# EAGLE design Motherboard (EAGLE 9.6.2)
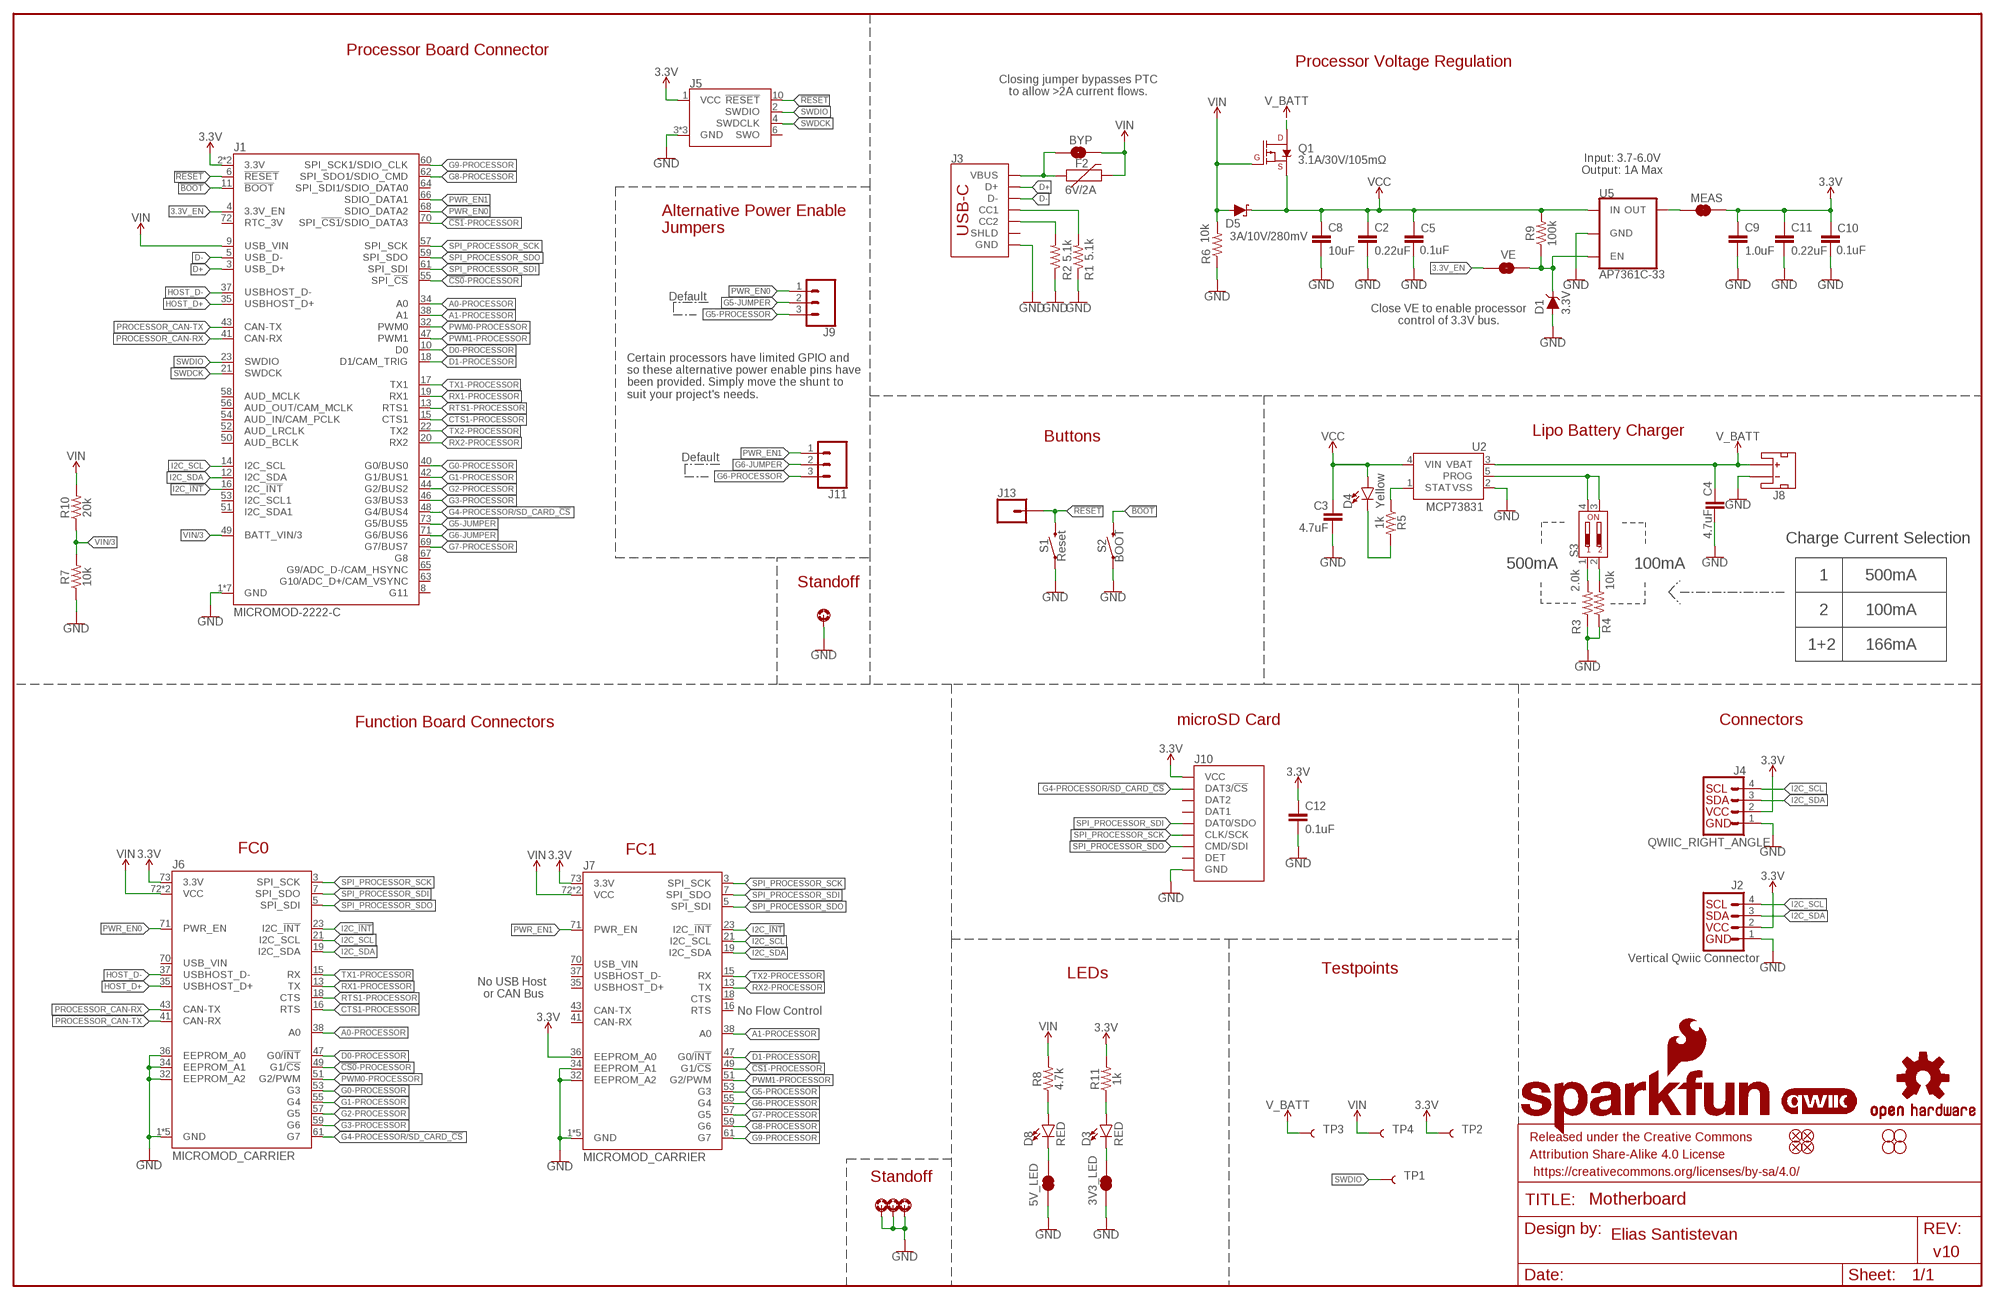
[diagram p0: schematic, sheet 1]

## Parts
3V3_LED  JUMPER-SMT_2_NC_TRACE_SILK  [SMT-JUMPER_2_NC_TRACE_SILK]
5V_LED  JUMPER-SMT_2_NC_TRACE_SILK  [SMT-JUMPER_2_NC_TRACE_SILK]
BYP  JUMPER-SMT_2_NO_SILK  [SMT-JUMPER_2_NO_SILK]
C2  0.22uF  0.22UF-0603-25V-10%  [0603]
C3  4.7uF  4.7UF-0603-6.3V-(10%)  [0603]
C4  4.7uF  4.7UF-0603-35V-(20%)  [0603]
C5  0.1uF  0.1UF-0603-25V-(+80/-20%)  [0603]
C8  10uF  10UF-0805-10V-10%  [0805]
C9  1.0uF  1.0UF-0603-16V-10%  [0603]
C10  0.1uF  0.1UF-0603-25V-(+80/-20%)  [0603]
C11  0.22uF  0.22UF-0603-25V-10%  [0603]
C12  0.1uF  0.1UF-0603-25V-(+80/-20%)  [0603]
D1  3.3V  DIODE-ZENER-MM3Z3V3T1G  [SOD-323]
D3  RED  LED-RED0603  [LED-0603]
D4  Yellow  LED-YELLOW0603  [LED-0603]
D5  3A/10V/280mV  DIODE-SCHOTTKY-BAT60A  [SOD-323]
D8  RED  LED-RED0603  [LED-0603]
F2  6V/2A  PPTC_6V2A  [1210]
FD1  FIDUCIAL1X2  [FIDUCIAL-1X2]
FD2  FIDUCIAL1X2  [FIDUCIAL-1X2]
FD3  FIDUCIAL1X2  [FIDUCIAL-1X2]
FD4  FIDUCIAL1X2  [FIDUCIAL-1X2]
FRAME1  FRAME-LEDGER  [CREATIVE_COMMONS]
H2  STAND-OFF-REFLOW-M2.5_2.5MM_TALL  [STAND-OFF-REFLOW-M2.5]
H3  STAND-OFF-REFLOW-M2.5_2.5MM_TALL  [STAND-OFF-REFLOW-M2.5]
H4  STAND-OFF-REFLOW-M2.5_2.5MM_TALL  [STAND-OFF-REFLOW-M2.5]
H8  STAND-OFF-REFLOW-M2.5_2.5MM_TALL  [STAND-OFF-REFLOW-M2.5]
H14  STAND-OFFTIGHT  [STAND-OFF-TIGHT]
H15  STAND-OFFTIGHT  [STAND-OFF-TIGHT]
H16  STAND-OFFTIGHT  [STAND-OFF-TIGHT]
H17  STAND-OFFTIGHT  [STAND-OFF-TIGHT]
J1  MICROMOD-2222-C  [M.2-CONNECTOR-E]
J2  Vertical Qwiic Connector  QWIIC_CONNECTOR  [JST04_1MM_VERT]
J3  USB_C_2-LAYER_PADS  [USB-C-16P-2LAYER-PADS]
J4  QWIIC_RIGHT_ANGLE  QWIIC_CONNECTORJS-1MM  [JST04_1MM_RA]
J5  CORTEX_JTAG_DEBUG_MINIMUM_PTH  [2X5-PTH-1.27MM]
J6  MICROMOD_CARRIER  [M.2-CONNECTOR-E-FUNCTION-STANDARD]
J7  MICROMOD_CARRIER  [M.2-CONNECTOR-E-FUNCTION-STANDARD]
J8  JST_2MM_MALE  [JST-2-SMD]
J9  CONN_03LOCK  [1X03_LOCK]
J10  MICRO-SD-PUSH-PUSH-EXT-PIN  [MICROSD-EXTERNALPIN]
J11  CONN_03LOCK  [1X03_LOCK]
J13  CONN_01PTH_NO_SILK_YES_STOP  [1X01_NO_SILK]
LOGO1  QWIIC_LOGO_8MM  [QWIIC_8MM]
LOGO2  SFE_LOGO_NAME_FLAME.3_INCH  [SFE_LOGO_NAME_FLAME_.3]
LOGO3  OSHW-LOGOL  [OSHW-LOGO-L]
MEAS  JUMPER-COMBO_2_NC_TRACE  [COMBO-JUMPER_2_NC_TRACE]
Q1  3.1A/30V/105mΩ  MOSFET_PCH-DMG2307L  [SOT23-3]
R1  5.1k  5.1KOHM5.1KOHM-0603-1/10W-1%  [0603]
R2  5.1k  5.1KOHM5.1KOHM-0603-1/10W-1%  [0603]
R3  2.0k  2.0KOHM-0603-1/10W-5%  [0603]
R4  10k  10KOHM-0603-1/10W-1%  [0603]
R5  1k  1KOHM-0603-1/10W-1%  [0603]
R6  10k  10KOHM-0603-1/10W-1%  [0603]
R7  10k  10KOHM-0603-1/10W-1%  [0603]
R8  4.7k  4.7KOHM-0603-1/10W-1%  [0603]
R9  100k  100KOHM-0603-1/10W-1%  [0603]
R10  20k  20KOHM-0603-1/10W-1%  [0603]
R11  1k  1KOHM-0603-1/10W-1%  [0603]
S1  Reset  MOMENTARY-SWITCH-SPST-SMD-5.2-TALL-REDUNDANT  [TACTILE_SWITCH_SMD_5.2MM]
S2  BOOT  MOMENTARY-SWITCH-SPST-SMD-5.2-TALL-REDUNDANT  [TACTILE_SWITCH_SMD_5.2MM]
S3  DIP-02-SMD-50MIL  [DIPSWITCH-02-50MIL]
TP1  TEST-POINT3X5  [PAD.03X.05]
TP2  TEST-POINT3X5  [PAD.03X.05]
TP3  TEST-POINT3X5  [PAD.03X.05]
TP4  TEST-POINT3X5  [PAD.03X.05]
U2  MCP73831  [SOT23-5]
U5  AP7361C-33  AP7361C-33FGEUDFN-8  [UDFN-8]
VE  JUMPER-SMT_2_NO_SILK  [SMT-JUMPER_2_NO_SILK]

## Nets
3.3V [POWER]: C9.1 C10.1 C11.1 C12.1 J1.2(3.3V) J1.74(3.3V) J2.2 J4.2 J5.1(VCC) J6.73(3.3V) J7.36(EEPROM_A0) J7.73(3.3V) J10.4(VCC) MEAS.2 MEAS.4 R11.2 TP2.1
3.3V_EN: J1.4(3.3V_EN) VE.1
3.3V_EN_VE: D1.C R9.1 U5.5(EN) VE.2
!BOOT!: J1.11(!BOOT!) S2.3 S2.4
!CS0!-PROCESSOR: J1.55(SPI_!CS!) J6.49(G1/!CS!)
!CS1!-PROCESSOR: J1.70(SPI_!CS1!/SDIO_DATA3) J7.49(G1/!CS!)
!RESET!: J1.6(!RESET!) J5.10(!RESET) J13.1 S1.3 S1.4
A0-PROCESSOR: J1.34(A0) J6.38(A0)
A1-PROCESSOR: J1.38(A1) J7.38(A0)
CTS1-PROCESSOR: J1.15(CTS1) J6.16(RTS)
D0-PROCESSOR: J1.10(D0) J6.47(G0/!INT!)
D1-PROCESSOR: J1.18(D1/CAM_TRIG) J7.47(G0/!INT!)
D+ [Diff pairs]: J1.3(USB_D+) J3.A6(D+) J3.B6(D+)
D- [Diff pairs]: J1.5(USB_D-) J3.A7(D-) J3.B7(D-)
G0-PROCESSOR: J1.40(G0/BUS0) J6.53(G3)
G1-PROCESSOR: J1.42(G1/BUS1) J6.55(G4)
G2-PROCESSOR: J1.44(G2/BUS2) J6.57(G5)
G3-PROCESSOR: J1.46(G3/BUS3) J6.59(G6)
G4-PROCESSOR/SD_CARD_!CS!: J1.48(G4/BUS4) J6.61(G7) J10.2(DAT3/!CS!)
G5-JUMPER: J1.73(G5/BUS5) J9.2
G5-PROCESSOR: J7.53(G3) J9.3
G6-JUMPER: J1.71(G6/BUS6) J11.2
G6-PROCESSOR: J7.55(G4) J11.3
G7-PROCESSOR: J1.69(G7/BUS7) J7.57(G5)
G8-PROCESSOR: J1.62(SPI_SDO1/SDIO_CMD) J7.59(G6)
G9-PROCESSOR: J1.60(SPI_SCK1/SDIO_CLK) J7.61(G7)
GND: 3V3_LED.1 5V_LED.1 C2.2 C3.2 C4.2 C5.2 C8.2 C9.2 C10.2 C11.2 C12.2 D1.A H2.1 H3.1 H4.1 H8.1 J1.1(GND) J1.7(GND) J1.33(GND) J1.36(GND) J1.39(GND) J1.45(GND) J1.75(GND) J2.1 J3.GND J3.GND2(GND) J4.1 J5.3(GND) J5.5(GND) J5.9(GND) J6.1(GND) J6.32(EEPROM_A2) J6.33(GND) J6.34(EEPROM_A1) J6.36(EEPROM_A0) J6.39(GND) J6.45(GND) J6.75(GND) J7.1(GND) J7.32(EEPROM_A2) J7.33(GND) J7.34(EEPROM_A1) J7.39(GND) J7.45(GND) J7.75(GND) J8.1(-) J10.6(GND) J10.10(GND) J10.11(GND) J10.12(GND) J10.13(GND) R1.1 R2.1 R3.1 R4.1 R6.1 R7.1 S1.1 S1.2 S2.1 S2.2 U2.2(VSS) U5.4(GND) U5.EP(GND)
HOST_D+ [Diff pairs]: J1.35(USBHOST_D+) J6.35(USBHOST_D+)
HOST_D- [Diff pairs]: J1.37(USBHOST_D-) J6.37(USBHOST_D-)
I2C_!INT!: J1.16(I2C_!INT!) J6.23(I2C_!INT!) J7.23(I2C_!INT!)
I2C_SCL: J1.14(I2C_SCL) J2.4 J4.4 J6.21(I2C_SCL) J7.21(I2C_SCL)
I2C_SDA: J1.12(I2C_SDA) J2.3 J4.3 J6.19(I2C_SDA) J7.19(I2C_SDA)
N$1: MEAS.1 MEAS.3 U5.1(OUT)
N$2: 5V_LED.2 D8.C
N$3: D3.A R11.1
N$4: J3.B5(CC2) R2.2
N$5: J3.A5(CC1) R1.2
N$6: S3.3 S3.4 U2.5(PROG)
N$7 [POWER]: BYP.1 F2.1 J3.VBUS1(VBUS) J3.VBUS2(VBUS)
N$8: R3.2 S3.1
N$9: R4.2 S3.2
N$10: 3V3_LED.2 D3.C
N$12: D8.A R8.1
N$14: D4.C R5.2
N$15: R5.1 U2.1(STAT)
PROCESSOR_CAN-RX: J1.41(CAN-RX) J6.43(CAN-TX)
PROCESSOR_CAN-TX: J1.43(CAN-TX) J6.41(CAN-RX)
PWM0-PROCESSOR: J1.32(PWM0) J6.51(G2/PWM)
PWM1-PROCESSOR: J1.47(PWM1) J7.51(G2/PWM)
PWR_EN0: J1.68(SDIO_DATA2) J6.71(PWR_EN) J9.1
PWR_EN1: J1.66(SDIO_DATA1) J7.71(PWR_EN) J11.1
RTS1-PROCESSOR: J1.13(RTS1) J6.18(CTS)
RX1-PROCESSOR: J1.19(RX1) J6.13(TX)
RX2-PROCESSOR: J1.20(RX2) J7.13(TX)
SPI_PROCESSOR_SCK: J1.57(SPI_SCK) J6.3(SPI_SCK) J7.3(SPI_SCK) J10.5(CLK/SCK)
SPI_PROCESSOR_SDI: J1.61(SPI_SDI) J6.7(SPI_SDO) J7.7(SPI_SDO) J10.7(DAT0/SDO)
SPI_PROCESSOR_SDO: J1.59(SPI_SDO) J6.5(SPI_SDI) J7.5(SPI_SDI) J10.3(CMD/SDI)
SWDCK: J1.21(SWDCK) J5.4(SWDCLK)
SWDIO: J1.23(SWDIO) J5.2(SWDIO) TP1.1
TX1-PROCESSOR: J1.17(TX1) J6.15(RX)
TX2-PROCESSOR: J1.22(TX2) J7.15(RX)
V_BATT [POWER]: C4.1 J8.2(+) Q1.3(D) TP3.1 U2.3(VBAT)
VCC: C2.1 C3.1 C5.1 C8.1 D4.A D5.C Q1.2(S) R9.2 U2.4(VIN) U5.8(IN)
VIN: BYP.2 D5.A F2.2 J1.9(USB_VIN) J6.72(VCC) J6.74(VCC) J7.72(VCC) J7.74(VCC) Q1.1(G) R6.2 R8.2 R10.2 TP4.1
VIN/3: J1.49(BATT_VIN/3) R7.2 R10.1
Unconnected: J1.8(G11) J1.50(AUD_BCLK) J1.51(I2C_SDA1) J1.52(AUD_LRCLK) J1.53(I2C_SCL1) J1.54(AUD_IN/CAM_PCLK) J1.56(AUD_OUT/CAM_MCLK) J1.58(AUD_MCLK) J1.63(G10/ADC_D+/CAM_VSYNC) J1.64(SPI_SDI1/SDIO_DATA0) J1.65(G9/ADC_D-/CAM_HSYNC) J1.67(G8) J1.72(RTC_3V) J3.SHLD1(SHLD) J3.SHLD2(SHLD) J3.SHLD3(SHLD) J3.SHLD4(SHLD) J5.6(SWO) J6.70(USB_VIN) J7.16(RTS) J7.18(CTS) J7.35(USBHOST_D+) J7.37(USBHOST_D-) J7.41(CAN-RX) J7.43(CAN-TX) J7.70(USB_VIN) J8.NC1(PAD1) J8.NC2(PAD2) J10.1(DAT2) J10.8(DAT1) J10.9(DET)

## Notes on the sheet
- Processor Board Connector
- Processor Voltage Regulation
- Closing jumper bypasses PTC
  to allow >2A current flows.
- Input: 3.7-6.0V
  Output: 1A Max
- Alternative Power Enable
  Jumpers
- Default
- Close VE to enable processor
  control of 3.3V bus.
- Certain processors have limited GPIO and
  so these alternative power enable pins have
  been provided. Simply move the shunt to 
  suit your project's needs.
- Lipo Battery Charger
- Buttons
- Default
- Charge Current Selection
- 500mA | 100mA
- 1 | 500mA
- Standoff
- 2 | 100mA
- 1+2 | 166mA
- Function Board Connectors | microSD Card | Connectors
- FC0 | FC1
- Testpoints
- LEDs
- No USB Host 
  or CAN Bus
- No Flow Control
- Standoff
- Elias Santistevan
- v10

## Library data of the parts
3V3_LED 5V_LED = SparkFun-Jumpers:JUMPER-SMT_2_NC_TRACE: Normally closed trace jumper This jumper has a trace between two pads so it's normally closed (NC). Use a razor knife to open the connection. For best results follow the IPC guidelines for cutting traces: Cutout at least 0.063 mm (0.005 in). Remove all loose material to clean up the cut area. Seal the cut with an approved epoxy. Reapply solder to reclose the connection.
BYP VE = SparkFun-Jumpers:JUMPER-SMT_2_NO: Normally open jumper This jumper has two pads in close proximity to each other. Apply solder to close the connection. Round pads are easier to solder for beginners, but are a lot larger. SparkFun Product that uses the round pads: SparkFun EL Sequencer <https://www.sparkfun.com/products/12781>
C2 C11 = SparkFun-Capacitors:0.22UF: 0.22µF ceramic capacitors A capacitor is a passive two-terminal electrical component used to store electrical energy temporarily in an electric field.; PROD_ID: CAP-07822
C3 = SparkFun-Capacitors:4.7UF: 4.7µF ceramic capacitors A capacitor is a passive two-terminal electrical component used to store electrical energy temporarily in an electric field.; PROD_ID: CAP-08280
C4 = SparkFun-Capacitors:4.7UF: 4.7µF ceramic capacitors A capacitor is a passive two-terminal electrical component used to store electrical energy temporarily in an electric field.; PROD_ID: CAP-14106
C5 C10 C12 = SparkFun-Capacitors:0.1UF: 0.1µF ceramic capacitors A capacitor is a passive two-terminal electrical component used to store electrical energy temporarily in an electric field.; PROD_ID: CAP-00810
C8 = SparkFun-Capacitors:10UF: 10.0µF ceramic capacitors A capacitor is a passive two-terminal electrical component used to store electrical energy temporarily in an electric field.; PROD_ID: CAP-11330
C9 = SparkFun-Capacitors:1.0UF: 1µF ceramic capacitors A capacitor is a passive two-terminal electrical component used to store electrical energy temporarily in an electric field.; PROD_ID: CAP-00868
D1 = SparkFun-DiscreteSemi:DIODE-ZENER: Zener Diode A Zener diode allows current to flow from its anode to its cathode like a normal semiconductor diode, but it also permits current to flow in the reverse direction when its "Zener voltage" is reached. - WIkipedia; PROD_ID: DIO-11284
D3 D8 = SparkFun-LED:LED-RED: Red SMD LED Used in manufacturing of most products at SparkFun Packages: 0603 - SMD 0603 package [Product Link] <http://docs.avagotech.com/docs/AV02-0551EN> 0603 SMART - SMD 0603 SMART package ( more efficient and expensive)[Product Link] <http://www.osram-os.com/Graphics/XPic2/00077099_0.pdf> 1206 - SMD1206 package [Product Link] <https://www.sparkfun.com/datasheets/DevTools/LilyPad/Q150OVS4.pdff> SparkFun Products: Pro Mini 328 -5V <https://www.sparkfun.com/products/821> RedBoard <https://www.sparkfun.com/products/12757> IOIO-OTG <https://www.sparkfun.com/products/13613>; PROD_ID: DIO-00819
D4 = SparkFun-LED:LED-YELLOW: Yellow SMD LED Used in manufacturing several products at SparkFun. Packages: 0603 - SMD 0603 package[Product Link] <http://www.kingbrightusa.com/product.asp?catalog_name=LED&product_id=APT1608SYCK> 0603 -SMART - SMART SMD 0603 package (more efficient/more expensive) [Product Link] <http://www.osram-os.com/osram_os/en/products/product-catalog/led-light-emitting-diodes/smartled-0603/ly-l29k/index.jsp> LilyPad - SMD1206 package[Product Datasheet] <https://www.sparkfun.com/datasheets/DevTools/LilyPad/Q150YUS4.pdf> SparkFun Products: Blynk Board <https://www.sparkfun.com/products/13794> IOIO-OTG <https://www.sparkfun.com/products/13613> XBee Explorer Serial <https://www.sparkfun.com/products/13225>; PROD_ID: DIO-09003
D5 = SparkFun-DiscreteSemi:DIODE-SCHOTTKY: Schottky diode A Schottky diode is a semiconductor diode which has a low forward voltage drop and a very fast switching action.; PROD_ID: DIO-14072
F2 = SparkFun-Fuses:PPTC: Resettable Fuse PPTC Resettable Fuse. Really a sort of resistor with a polymeric positive temperature coefficient whose resistance increases dramatically with an increase in temperature. When heated by the power passing through the resistance rises causing the current to be limited, protecting the circuit. This is achieved by the transition of the polymer from a crystalline to an amorphous state where the conductive carbon separates breaking the conductive pathways found in the cool crystalline structure. When a PPTC cools back down it resumes conducting letting the circuit turn back on. SparkFun Products: SparkFun RedBoard - Programmed with Arduino <https://www.sparkfun.com/products/12757> Pro Micro - 5V/16MHz <https://www.sparkfun.com/products/12640> Arduino Pro 328 - 5V/16MHz <https://www.sparkfun.com/products/10915> MP3 Trigger <https://www.sparkfun.com/products/13720>; PROD_ID: RES-14313
FD1-FD4 = SparkFun-Aesthetics:FIDUCIAL: Fiducial Alignment Points Point-of-reference for pick-and-place machines and other optical instruments.
FRAME1 = SparkFun-Aesthetics:FRAME-LEDGER: Schematic Frame - Ledger Standard 11x14 US Ledger frame
H2-H4 H8 = SparkFun-Hardware:STAND-OFF-REFLOW: Stand Off Reflow Compatible A metal standoff that can be placed and reflowed onto a PCB. The M2.5 x 2.5mm variant is used on MicroMod. The M2.0 x 6.0mm variant is used to mount the Iridium 9603N modem.; PROD_ID: HW-14899
H14-H17 = SparkFun-Hardware:STAND-OFF: Stand Off Drill holes for mechanically mounting via screws, standoffs, etc. Note: Use the keepout ring to avoid running the screw head into surrounding components. Variant Overviews STAND-OFF - Mechanical footprint for a #4 phillips button head screw. STAND-OFF-TIGHT - Mechanical footprint for a #4 phillips button head screw, Example SparkFun Products Screw - Phillips Head (1/4", 4-40, 10 pack) <https://www.sparkfun.com/products/10453> (PRT-10453) Screw - Phillips Head (1/2", 4-40, 10 pack) <https://www.sparkfun.com/products/10452> (PRT-10452) Screw - Phillips Head (3/4", 4-40, 10 pack) <https://www.sparkfun.com/products/10451> (PRT-10451) Screw - Phillips Head (1", 4-40, 10 pack) <https://www.sparkfun.com/products/10450> (PRT-10450)
J1 = SparkFun-MicroMod:MICROMOD: MicroMod Connector Description: A card edge connector and mating PCB connector to allow various MicroMod Processor Boards to be coupled with various carrier boards of different capabilities. Based on the M.2 standard.; PROD_ID: CONN-14877
J2 = SparkFun-Connectors:QWIIC_CONNECTOR: SparkFun I2C Standard Qwiic Connector An SMD 1mm pitch JST connector makes it easy and quick (get it? Qwiic?) to connect I2C devices to each other. The Qwiic system <http://www.sparkfun.com/qwiic> enables fast and solderless connection between popular platforms and various sensors and actuators. We carry 200mm <https://www.sparkfun.com/products/14204>, 100mm <https://www.sparkfun.com/products/14205>, 50mm <https://www.sparkfun.com/products/14206>, and breadboard friendly <https://www.sparkfun.com/products/14207> Qwiic cables. We also offer 10 pcs strips <https://www.sparkfun.com/products/14323> the SMD connectors.; PROD_ID: CONN-14483
J3 = SparkFun-Connectors:USB_C: USB Type C 16Pin Connector Super Speed pins not available on the 16-pin purely SMD connector so this part is best for USB 2.0 implementations. D1 and D2 are tied together enabling D+/- no matter which way the cable is plugged into the connector. The two channel configuration pins (CC1/2) are exposed. These are normally connected to ground via 5.1k resistors but can be reconfigured for high current/high power applications. **4-LAYER BOARD WARNING!!** If designing 4-layer board, make sure to select the variant _4-LAYER-ISOLATED. The linked footprint (USB-C-16-4LAYER-ISOLATED) includes some very necessary cutout polygons in the inner layers (2 and 15). This prevents the PTH mounting shield legs on the USB connector from electrically connecting any other polygons on the inner layers (usually VCC and GND).; PROD_ID: CONN-14122
J4 = SparkFun-Connectors:QWIIC_CONNECTOR: SparkFun I2C Standard Qwiic Connector An SMD 1mm pitch JST connector makes it easy and quick (get it? Qwiic?) to connect I2C devices to each other. The Qwiic system <http://www.sparkfun.com/qwiic> enables fast and solderless connection between popular platforms and various sensors and actuators. We carry 200mm <https://www.sparkfun.com/products/14204>, 100mm <https://www.sparkfun.com/products/14205>, 50mm <https://www.sparkfun.com/products/14206>, and breadboard friendly <https://www.sparkfun.com/products/14207> Qwiic cables. We also offer 10 pcs strips <https://www.sparkfun.com/products/14323> the SMD connectors.; PROD_ID: CONN-13694
J5 = SparkFun-Connectors:CORTEX_JTAG_DEBUG_MINIMUM: Cortex Debug Connector - 10 pin Supports JTAG debug, Serial Wire debug, and Serial Wire Viewer. PTH and SMD connector options available. General Connector Information <http://infocenter.arm.com/help/topic/com.arm.doc.faqs/attached/13634/cortex_debug_connectors.pdf> Products: PTH Connector <http://www.digikey.com/product-detail/en/cnc-tech/3220-10-0100-00/1175-1627-ND/3883661> -via Digi-Key SparkFun PSoc <https://www.sparkfun.com/products/13229> SparkFun T <https://www.sparkfun.com/products/13810>
J6 J7 = SparkFun-MicroMod-Function:MICROMOD: MicroMod Connector Description: A card edge connector and mating PCB connector to allow various MicroMod Processor Boards to be coupled with various carrier boards of different capabilities. Based on the M.2 standard.; PROD_ID: CONN-14877
J8 = SparkFun-Connectors:JST_2MM_MALE: JST 2MM MALE RA CONNECTOR Two pin, compact surface mount connector. Commonly used as a battery input connection point. We really like the solid locking feeling and high current rating on these small connectors. We use these all the time as battery connectors. Mates to single-cell LiPo batteries. Here is the connector we sell at SparkFun: JST Right Angle Connector - White <https://www.sparkfun.com/products/8612> (PRT-08612) Datasheet <http://www.sparkfun.com/datasheets/Prototyping/Connectors/JST-Horizontal.pdf> It was used on these SparkFun products: SparkFun MOSFET Power Controller <https://www.sparkfun.com/products/11214> (PRT-11214) SparkFun Battery Babysitter - LiPo Battery Manager <https://www.sparkfun.com/products/13777> (PRT-13777) And many, many others that required a lipo battery connection.; PROD_ID: CONN-11443; SF_ID: PRT-08612
J9 J11 = SparkFun-Connectors:CONN_03: Multi connection point. Often used as Generic Header-pin footprint for 0.1 inch spaced/style header connections On any of the 0.1 inch spaced packages, you can populate with these: Break Away Headers - Straight <https://www.sparkfun.com/products/116> (PRT-00116) Break Away Male Headers - Right Angle <https://www.sparkfun.com/products/553> (PRT-00553) Female Headers <https://www.sparkfun.com/products/115> (PRT-00115) Break Away Headers - Machine Pin <https://www.sparkfun.com/products/117> (PRT-00117) Break Away Female Headers - Swiss Machine Pin <https://www.sparkfun.com/products/743> (PRT-00743) Stackable Header - 3 Pin (Female, 0.1") <https://www.sparkfun.com/products/13875> (PRT-13875) For SCREWTERMINALS and SPRING TERMINALS visit here: Screw Terimnals on SparkFun.com <https://www.sparkfun.com/search/results?term=Screw+Terminals> (5mm/3.5mm/2.54mm spacing) This device is also useful as a general connection point to wire up your design to another part of your project. Our various solder wires solder well into these plated through hole pads. Hook-Up Wire - Assortment (Stranded, 22 AWG) <https://www.sparkfun.com/products/11375> (PRT-11375) Hook-Up Wire - Assortment (Solid Core, 22 AWG) <https://www.sparkfun.com/products/11367> (PRT-11367) View the entire wire category on our website here <https://www.sparkfun.com/categories/141> Special notes: Molex polarized connector foot print use with SKU : PRT-08232 with associated crimp pins and housings.
J10 = SparkFun-Connectors:MICRO-SD: microSD Socket for Transflash Various sockets for µSD. tDoc lines correctly indicate media card edge positions when inserting (unlocked, locked, depressed). NOTE: CD1 and CD2 are connected internally, and the default detect state of the socket is detect pin to ground. SparkFun Products: WAV Trigger <https://www.sparkfun.com/products/13660> CAN-Bus Shield <https://www.sparkfun.com/products/13262> SparkFun Level Shifing microSD Breakout <https://www.sparkfun.com/products/13743>; PROD_ID: CONN-16110
J13 = SparkFun-Connectors:CONN_01: Single connection point. Often used as Generic Header-pin footprint for 0.1 inch spaced/style header connections On any of the 0.1 inch spaced packages, you can populate with these: Break Away Headers - Straight <https://www.sparkfun.com/products/116> (PRT-00116) Break Away Male Headers - Right Angle <https://www.sparkfun.com/products/553> (PRT-00553) Female Headers <https://www.sparkfun.com/products/115> (PRT-00115) Break Away Headers - Machine Pin <https://www.sparkfun.com/products/117> (PRT-00117) Break Away Female Headers - Swiss Machine Pin <https://www.sparkfun.com/products/743> (PRT-00743) This device is also useful as a general connection point to wire up your design to another part of your project. Our various solder wires solder well into these plated through hole pads. Hook-Up Wire - Assortment (Stranded, 22 AWG) <https://www.sparkfun.com/products/11375> (PRT-11375) Hook-Up Wire - Assortment (Solid Core, 22 AWG) <https://www.sparkfun.com/products/11367> (PRT-11367) View the entire wire category on our website here <https://www.sparkfun.com/categories/141> Special notes: SMTSO-256-ET is a "flush mount" nut for a 4-40 screw. We mostly use this on specialty testbeds; it is a nice way to connect hardware to your PCB at an adjustable hieght. Also note, the SNAP packages are for using a snappable style connector. We sell a baggie of snaps and they are also used on two LilyPad designs: Snap Assortment - 30 pack (male and female) <https://www.sparkfun.com/products/11347> (DEV-11347) LilyPad Arduino SimpleSnap <https://www.sparkfun.com/products/10941> (DEV-10941) LilyPad SimpleSnap Protoboard <https://www.sparkfun.com/products/10940> (DEV-10940)
LOGO1 = SparkFun-Aesthetics:QWIIC_LOGO: Qwiic Logos for placement on schematic and PCB. The 5.5mm silk logo is best for placing next to Qwiic connector.
LOGO2 = SparkFun-Aesthetics:SFE_LOGO_NAME_FLAME: SparkFun Font Logo w/ Flame This is the SparkFun full logo. The logo on the schematic will always be the same size; the package variant is the height of the flame part of the logo. Default layer for the logo on the board is tSilk.
LOGO3 = SparkFun-Aesthetics:OSHW-LOGO: Open-Source Hardware (OSHW) Logo This logo indicates the piece of hardware it is found on incorporates a OSHW license and/or adheres to the definition of open source hardware found here: http://freedomdefined.org/OSHW
MEAS = SparkFun-Jumpers:JUMPER-COMBO_2_NC_TRACE
Q1 = SparkFun-DiscreteSemi:MOSFET_PCH: P-channel MOSFETs Voltage controlled devices that allow control of high current outputs. SparkFun Products: SparkFun ESP32 Thing <https://www.sparkfun.com/products/13907> SparkFun ESP8266 Thing <https://www.sparkfun.com/products/13231> SparkFun Pi Servo HAT V2 <https://www.sparkfun.com/products/15316> DMG2305UX-7 (20V/4.2A/SOT23-3); PROD_ID: TRANS-11308
R1 R2 = SparkFun-Resistors:5.1KOHM; PROD_ID: RES-12083
R3 = SparkFun-Resistors:2.0KOHM: 2kΩ resistor A resistor is a passive two-terminal electrical component that implements electrical resistance as a circuit element. Resistors act to reduce current flow, and, at the same time, act to lower voltage levels within circuits. - Wikipedia; PROD_ID: RES-08296
R4 R6 R7 = SparkFun-Resistors:10KOHM: 10kΩ resistor A resistor is a passive two-terminal electrical component that implements electrical resistance as a circuit element. Resistors act to reduce current flow, and, at the same time, act to lower voltage levels within circuits. - Wikipedia; PROD_ID: RES-00824
R5 R11 = SparkFun-Resistors:1KOHM: 1kΩ resistor A resistor is a passive two-terminal electrical component that implements electrical resistance as a circuit element. Resistors act to reduce current flow, and, at the same time, act to lower voltage levels within circuits. - Wikipedia; PROD_ID: RES-07856
R8 = SparkFun-Resistors:4.7KOHM: 4.7kΩ resistor A resistor is a passive two-terminal electrical component that implements electrical resistance as a circuit element. Resistors act to reduce current flow, and, at the same time, act to lower voltage levels within circuits. - Wikipedia; PROD_ID: RES-07857
R9 = SparkFun-Resistors:100KOHM: 100kΩ resistor A resistor is a passive two-terminal electrical component that implements electrical resistance as a circuit element. Resistors act to reduce current flow, and, at the same time, act to lower voltage levels within circuits. - Wikipedia; PROD_ID: RES-07828
R10 = SparkFun-Resistors:20KOHM: 20kΩ resistor A resistor is a passive two-terminal electrical component that implements electrical resistance as a circuit element. Resistors act to reduce current flow, and, at the same time, act to lower voltage levels within circuits. - Wikipedia; PROD_ID: RES-09383
S1 S2 = SparkFun-Switches:MOMENTARY-SWITCH-SPST: Momentary Switch (Pushbutton) - SPST Normally-open (NO) SPST momentary switches (buttons, pushbuttons). Variants PTH-12MM - 12mm square, through-hole Momentary Pushbutton Switch - 12mm Square <https://www.sparkfun.com/products/9190> (COM-09190) PTH-6.0MM, PTH-6.0MM-KIT - 6.0mm square, through-hole Mini Pushbutton Switch <https://www.sparkfun.com/products/97> (COM-00097) KIT package intended for soldering kit's - only one side of pads' copper is exposed. PTH-RIGHT-ANGLE-KIT - Right-angle, through-hole Right Angle Tactile Button <https://www.sparkfun.com/products/10791> - Used on SparkFun BigTime Watch Kit <https://www.sparkfun.com/products/11734> SMD-12MM - 12mm square, surface-mount Tactile Button - SMD (12mm) <https://www.sparkfun.com/products/12993> (COM-12993) Used on SparkFun PicoBoard <https://www.sparkfun.com/products/11888> SMD-4.5MM - 4.5mm Square Trackball Switch Used on SparkFun Blackberry Trackballer Breakout <https://www.sparkfun.com/products/13169> SMD-4.6MMX2.8MM - 4.60mm x 2.80mm, surface mount Used on SparkFun Pro Micro - RP2040 <https://www.sparkfun.com/products/17717> SMD-5.2MM, SMD-5.2-REDUNDANT - 5.2mm square, surface-mount Mini Pushbutton Switch - SMD <https://www.sparkfun.com/products/8720> (COM-08720) Used on Arduino Pro Mini <https://www.sparkfun.com/products/11114> REDUNDANT package connects both switch circuits together SMD-6.0X3.5MM - 6.0 x 3.5mm, surface mount Momentary Reset Switch SMD <https://www.sparkfun.com/products/8229> (COM-08229) SMD-6.2MM-TALL - 6.2mm square, surface mount Tactile Button - SMD (6mm) <https://www.sparkfun.com/products/12992> Used on SparkFun Digital Sandbox <https://www.sparkfun.com/products/12651> SMD-RIGHT-ANGLE - Right-angle, surface mount Used on SparkFun Block for Intel® Edison - Arduino <https://www.sparkfun.com/products/13036>; PROD_ID: SWCH-14139
S3 = SparkFun-Switches:DIP-02: 2-Position DIP Switch 2-circuit DIP (dual inline package) switch. Commonly used to physcially set a circuit's behavior. Variants PTH-100MIL - Through-hole, 0.1"-Pitch Used on SparkFun Stepoko <https://www.sparkfun.com/products/13899> (ROB-13899) SMD-50MIL-JWING - SMD (J-Wing Pads), 0.05"-Pitch Prototype Part SMD-50MIL - SMD, 0.05"-Pitch Used on SparkFun Battery Babysitter <https://www.sparkfun.com/products/13777> (PRT-13777); PROD_ID: SWCH-13215
TP1-TP4 = SparkFun-Connectors:TEST-POINT: SparkFun Test Points Bare copper test points for troubleshooting or In-Circuit-Testing. These are used by our Production team for verifying production board runs using pogo-pins on test beds. SparkFun Products: SparkFun LSM9DS1 Breakout <https://www.sparkfun.com/products/13284> SparkFun PSOC <https://www.sparkfun.com/products/13714> SparkFun Load Cell Amplifier <https://www.sparkfun.com/products/13879>
U2 = SparkFun-IC-Power:MCP73831: MCP73831T Li-Ion, Li-Pol Controller Miniature single cell, fully integrated Li-Ion, Li-polymer charge management controller Datasheet <http://ww1.microchip.com/downloads/en/DeviceDoc/20001984g.pdf> SparkFun Products: SparkFun ESP32 Thing <https://www.sparkfun.com/products/13907> SparkFun 9DoF Razor IMU M0 <https://www.sparkfun.com/products/14001>; PROD_ID: IC-09995
U5 = SparkFun-IC-Power:AP7361C-33FGE: AP7361C 3.3V LDO Regulator; PROD_ID: VREG-14094

## Net classes
0 default: width 0.178 mm, drill 0.305 mm
1 POWER: width 0.559 mm, drill 0.305 mm
2 Diff pairs: width 0.203 mm, drill 0.305 mm

## Board
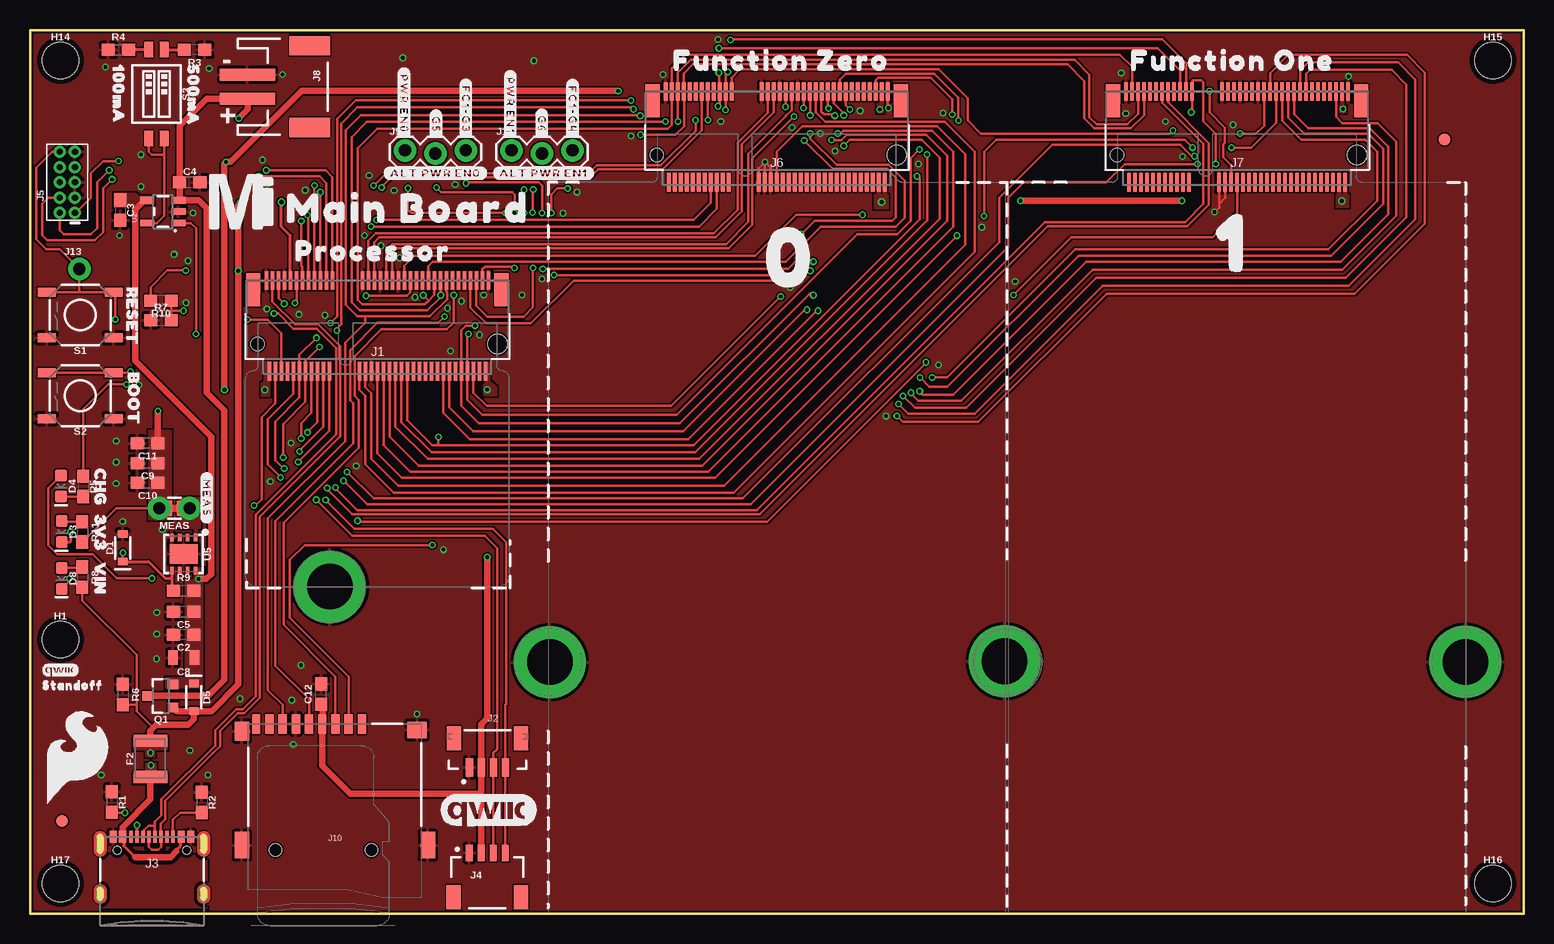
[diagram p1: board, top side]
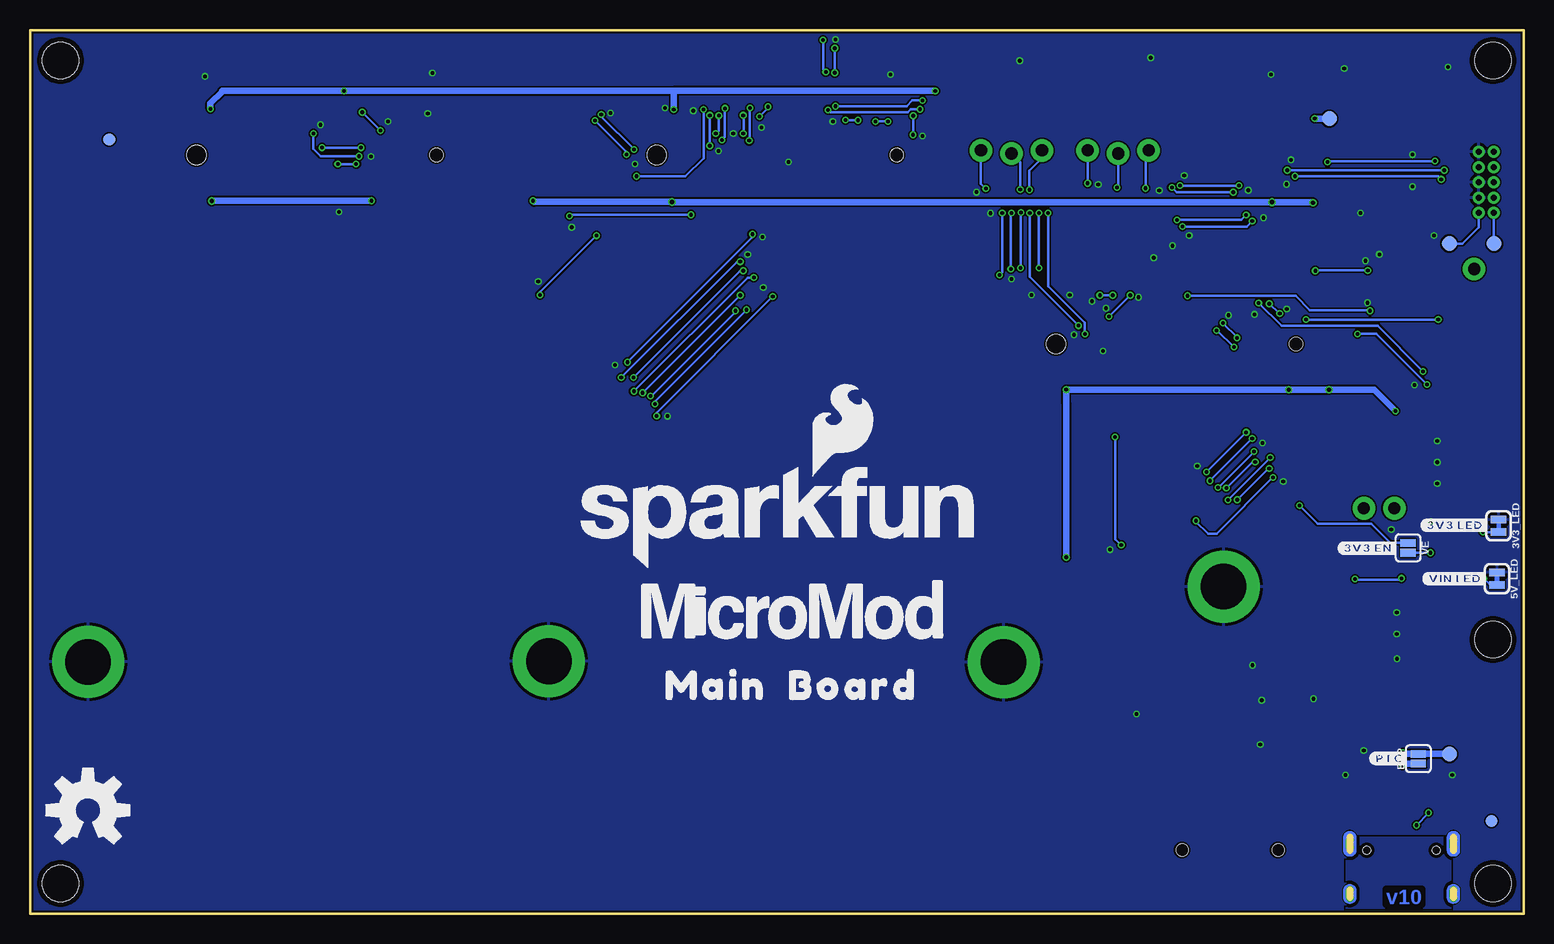
[diagram p2: board, bottom side, seen from below]

Size 124.46 x 73.66 mm. Coordinates in mm from the lower left corner, seen from the top.
Outline: 124.46,0 0,0 0,73.66 124.46,73.66 124.46,0
Copper layers (1*16): Top 0.035mm / dielectric 1.5mm / Bottom 0.035mm
Design rules "SparkFun-2-Layer-Minimum-JLCPCB": minimum track width 5mil, minimum drill 0.3mm, track to track 5mil, track to pad 5mil, pad to pad 5mil, via to via 5mil, smd to smd 5mil, copper to edge 7mil, drill to drill 7mil, minimum pad ring 5mil, minimum via ring 5mil, stop-mask expansion 2.5mil, vias tented up to drill 25mil, thermal gap 10mil
tRestrict: area 99.3,60.8 to 99.4,61.1; area 98.7,60.8 to 98.9,61.2; area 61.4,60.8 to 61.5,61.2; area 60.9,60.8 to 61,61.2

### Footprints (pad centres in the part's own frame; a part is rotated, then mirrored left to right if it is on the bottom)
SMT-JUMPER_2_NC_TRACE_SILK = smd 0.66 x 1.27: 1 -0.521,0; 2 0.521,0
SMT-JUMPER_2_NO_SILK = smd 0.635 x 1.27: 1 -0.406,0; 2 0.406,0
0603 = smd 1.1 x 1: 1 -0.85,0; 2 0.85,0
0805 = smd 0.8 x 1.2: 1 -0.9,0; 2 0.9,0
SOD-323 = smd 0.63 x 0.83: A 1.15,0; C -1.15,0
LED-0603 = smd 1 x 1: A -0.877,0; C 0.877,0
1210 = smd 1 x 2.8: 1 -1.5,0; 2 1.5,0
FIDUCIAL-1X2 = smd 1 x 1: 1 0,0
STAND-OFF-TIGHT = hole 3.048: 0,0
STAND-OFF-REFLOW-M2.5 = drill 3.8 pad 6: 1 0,0
M.2-CONNECTOR-E = smd 0.3 x 1.55: 1 9.25,-5.275; 2 9,2.275; 3 8.75,-5.275; 4 8.5,2.275; 5 8.25,-5.275; 6 8,2.275; 7 7.75,-5.275; 8 7.5,2.275; 9 7.25,-5.275; 10 7,2.275; 11 6.75,-5.275; 12 6.5,2.275; 13 6.25,-5.275; 14 6,2.275; 15 5.75,-5.275; 16 5.5,2.275; 17 5.25,-5.275; 18 5,2.275; 19 4.75,-5.275; 20 4.5,2.275; 21 4.25,-5.275; 22 4,2.275; 23 3.75,-5.275; 32 1.5,2.275; 33 1.25,-5.275; 34 1,2.275; 35 0.75,-5.275; 36 0.5,2.275; 37 0.25,-5.275; 38 0,2.275; 39 -0.25,-5.275; 40 -0.5,2.275; 41 -0.75,-5.275; 42 -1,2.275; 43 -1.25,-5.275; 44 -1.5,2.275; 45 -1.75,-5.275; 46 -2,2.275; 47 -2.25,-5.275; 48 -2.5,2.275; 49 -2.75,-5.275; 50 -3,2.275; 51 -3.25,-5.275; 52 -3.5,2.275; 53 -3.75,-5.275; 54 -4,2.275; 55 -4.25,-5.275; 56 -4.5,2.275; 57 -4.75,-5.275; 58 -5,2.275; 59 -5.25,-5.275; 60 -5.5,2.275; 61 -5.75,-5.275; 62 -6,2.275; 63 -6.25,-5.275; 64 -6.5,2.275; 65 -6.75,-5.275; 66 -7,2.275; 67 -7.25,-5.275; 68 -7.5,2.275; 69 -7.75,-5.275; 70 -8,2.275; 71 -8.25,-5.275; 72 -8.5,2.275; 73 -8.75,-5.275; 74 -9,2.275; 75 -9.25,-5.275 | smd 1.2 x 2.75: A1 10.35,-4.5; A2 -10.35,-4.5 | hole 1.1: 10,0 | hole 1.6: -10,0
JST04_1MM_VERT = smd 0.6 x 1.55: 1 -1.478,0.775; 2 -0.478,0.775; 3 0.522,0.775; 4 1.522,0.775 | smd 1.2 x 2: NC1 -2.778,3.2; NC2 2.822,3.2
USB-C-16P-2LAYER-PADS = smd 0.3 x 1: A5 -1.25,-0.34; A6 -0.25,-0.34; A7 0.25,-0.34; A8 1.25,-0.34; B5 1.75,-0.34; B6 0.75,-0.34; B7 -0.75,-0.34; B8 -1.75,-0.34 | smd 0.6 x 1: GND -3.225,-0.34; GND2 3.225,-0.34; VBUS1 -2.45,-0.34; VBUS2 2.45,-0.34 | drill 0.4 pad 0.6 long: SHLD1 -4.318,-0.915; SHLD2 4.318,-0.915; SHLD3 -4.318,-5.095; SHLD4 4.318,-5.095 | hole 0.65: -2.89,-1.445; 2.89,-1.445
JST04_1MM_RA = smd 0.6 x 1.35: 1 -1.5,0; 2 -0.5,0; 3 0.5,0; 4 1.5,0 | smd 1.2 x 2: NC1 2.8,-3.675; NC2 -2.8,-3.675
2X5-PTH-1.27MM = drill 0.508 pad 1: 1 -2.54,-0.635; 2 -2.54,0.635; 3 -1.27,-0.635; 4 -1.27,0.635; 5 0,-0.635; 6 0,0.635; 7 1.27,-0.635; 8 1.27,0.635; 9 2.54,-0.635; 10 2.54,0.635
M.2-CONNECTOR-E-FUNCTION-STANDARD = smd 0.3 x 1.55: 1 9.25,-5.275; 2 9,2.275; 3 8.75,-5.275; 4 8.5,2.275; 5 8.25,-5.275; 6 8,2.275; 7 7.75,-5.275; 8 7.5,2.275; 9 7.25,-5.275; 10 7,2.275; 11 6.75,-5.275; 12 6.5,2.275; 13 6.25,-5.275; 14 6,2.275; 15 5.75,-5.275; 16 5.5,2.275; 17 5.25,-5.275; 18 5,2.275; 19 4.75,-5.275; 20 4.5,2.275; 21 4.25,-5.275; 22 4,2.275; 23 3.75,-5.275; 32 1.5,2.275; 33 1.25,-5.275; 34 1,2.275; 35 0.75,-5.275; 36 0.5,2.275; 37 0.25,-5.275; 38 0,2.275; 39 -0.25,-5.275; 40 -0.5,2.275; 41 -0.75,-5.275; 42 -1,2.275; 43 -1.25,-5.275; 44 -1.5,2.275; 45 -1.75,-5.275; 46 -2,2.275; 47 -2.25,-5.275; 48 -2.5,2.275; 49 -2.75,-5.275; 50 -3,2.275; 51 -3.25,-5.275; 52 -3.5,2.275; 53 -3.75,-5.275; 54 -4,2.275; 55 -4.25,-5.275; 56 -4.5,2.275; 57 -4.75,-5.275; 58 -5,2.275; 59 -5.25,-5.275; 60 -5.5,2.275; 61 -5.75,-5.275; 62 -6,2.275; 63 -6.25,-5.275; 64 -6.5,2.275; 65 -6.75,-5.275; 66 -7,2.275; 67 -7.25,-5.275; 68 -7.5,2.275; 69 -7.75,-5.275; 70 -8,2.275; 71 -8.25,-5.275; 72 -8.5,2.275; 73 -8.75,-5.275; 74 -9,2.275; 75 -9.25,-5.275 | smd 1.2 x 2.75: A1 10.35,-4.5; A2 -10.35,-4.5 | hole 1.1: 10,0 | hole 1.6: -10,0
JST-2-SMD = smd 1 x 4.6: 1 -1,-3.7; 2 1,-3.7 | smd 1.6 x 3.4: NC1 -3.4,1.5; NC2 3.4,1.5
1X03_LOCK = drill 1.016 pad 1.88: 1 0,0.127; 2 2.54,-0.127; 3 5.08,0.127
MICROSD-EXTERNALPIN = smd 0.7 x 1.6: 1 2.25,10.5; 2 1.15,10.5; 3 0.05,10.5; 4 -1.05,10.5; 5 -2.15,10.5; 6 -3.25,10.5; 7 -4.35,10.5; 8 -5.45,10.5; 9 -6.55,10.5 | smd 1.2 x 1.6: 10 -7.75,9.9 | smd 1.2 x 2.2: 11 -7.75,0.4; 12 7.75,0.4 | smd 1.6 x 1.4: 13 6.85,10 | hole 1: 3.05,0; -4.95,0
1X01_NO_SILK = drill 1.016 pad 1.88: 1 0,0
COMBO-JUMPER_2_NC_TRACE = smd 0.635 x 1.27: 1 -0.508,0; 2 0.508,0 | drill 1.016 pad 1.88: 3 -1.27,0; 4 1.27,0
SOT23-3 = smd 0.8 x 0.9: 1 -0.95,-1; 2 0.95,-1; 3 0,1.1
TACTILE_SWITCH_SMD_5.2MM = smd 1.524 x 0.762: 1 -2.794,1.905; 2 2.794,1.905; 3 -2.794,-1.905; 4 2.794,-1.905
DIPSWITCH-02-50MIL = smd 0.762 x 1.27: 1 -0.635,-3.7; 2 0.635,-3.7; 3 0.635,3.7; 4 -0.635,3.7
PAD.03X.05 = smd 1.27 x 1.27: 1 0,0
SOT23-5 = smd 0.55 x 1.2: 1 -0.95,-1.3; 2 0,-1.3; 3 0.95,-1.3; 4 0.95,1.3; 5 -0.95,1.3
UDFN-8 = smd 0.3 x 0.65: 1 -0.975,-1.375; 2 -0.325,-1.375; 3 0.325,-1.375; 4 0.975,-1.375; 5 0.975,1.375; 6 0.325,1.375; 7 -0.325,1.375; 8 -0.975,1.375 | smd 2.35 x 1.6: EP 0,0

### Placement (x,y rotation side)
3V3_LED  2.08,32.35 270 bottom
5V_LED  2.21,27.93 270 bottom
BYP  8.76,12.93 90 bottom
C2  12.8,23.27 180 top
C3  7.52,58.65 270 top
C4  13.31,60.99 0 top
C5  12.8,25.17 180 top
C8  12.8,21.36 180 top
C9  9.8,37.57 180 top
C10  9.8,35.92 180 top
C11  9.8,39.22 180 top
C12  24.26,18.31 90 top
D1  7.72,30.51 90 top
D3  2.64,31.87 270 top
D4  2.59,35.66 270 top
D5  13.67,18.06 270 top
D8  2.64,27.96 270 top
F2  10.03,12.93 90 top
FD1  117.86,64.52 0 bottom
FD2  117.86,64.52 0 top
FD3  2.67,7.75 90 top
FD4  2.67,7.75 270 bottom
FRAME1  16.51,-25.4 0 top  (outside the outline)
FRAME2  FRAME-LEDGERNO_FOOTPRINT  [DUMMY]  16.51,-25.4 0 top  (outside the outline)
H1  STAND-OFFTIGHT  [STAND-OFF-TIGHT]  2.54,22.86 0 top
H2  81.22,21.06 0 top
H3  119.62,21.01 270 top
H4  43.32,20.98 270 top
H8  25,27.27 270 top
H14  2.54,71.12 0 top
H15  121.92,71.12 0 top
H16  121.92,2.54 0 top
H17  2.54,2.54 0 top
J1  28.96,47.5 180 top
J2  38.1,11.43 0 top
J3  10.16,6.76 0 top
J4  38.1,5.08 0 top
J5  3.11,60.97 90 top
J6  62.23,63.25 180 top
J7  100.58,63.25 180 top
J8  21.82,68.94 270 top
J9  31.24,63.5 0 top
J10  25.4,5.33 0 top
J11  40.13,63.5 0 top
J13  4.11,53.75 0 top
LOGO1  38.23,8.64 0 top
LOGO2  62.23,33.02 0 bottom
LOGO3  119.63,8.64 0 bottom
MEAS  12.04,33.81 180 top
Q1  10.92,18.16 90 top
R1  6.83,9.32 270 top
R2  14.33,9.3 270 top
R3  13.72,72.01 180 top
R4  7.37,72.01 0 top
R5  4.45,35.63 270 top
R6  7.75,18.29 270 top
R7  10.92,49.48 0 top
R8  4.37,28.06 270 top
R9  12.8,26.95 0 top
R10  10.92,51.1 180 top
R11  4.37,31.84 270 top
S1  4.19,49.91 180 top
S2  4.19,43.18 180 top
S3  10.54,68.33 180 top
TP1  2.44,55.86 0 bottom
TP2  6.17,55.87 180 bottom
TP3  16.18,66.27 270 bottom
TP4  6.17,13.31 0 bottom
U2  11.07,58.52 90 top
U5  12.8,30 180 top
U$1  [#3V3_EN#18]  12.95,30.48 0 bottom
U$2  [#3V3_LED#17]  5.71,32.38 0 bottom
U$3  [#VIN_LED#16]  5.71,27.94 0 bottom
U$4  [3V332533]  5.84,31.75 270 top
U$5  [VIN32532]  5.84,27.94 270 top
U$6  [CHG32531]  5.84,35.56 270 top
U$7  [#PTC#18]  11.18,12.95 0 bottom
U$8  [BOOT32541]  8.64,42.93 270 top
U$9  [RESET32540]  8.51,49.78 270 top
U$10  [PROCESSOR525]  28.57,55.24 0 top
U$11  [FUNCTION_ZERO520]  62.61,71.12 0 top
U$12  [FUNCTION_ONE524]  100.2,71.12 0 top
U$13  [MAIN523]  67.31,19.05 0 bottom
U$14  [MICROMOD_MI_LOGO_1]  17.65,59.39 0 top
U$15  [0523]  63.5,54.61 0 top
U$16  [1524]  100.33,55.88 0 top
U$17  [MICROMOD_LOGO_1]  60.96,25.4 0 bottom
U$18  [BOARD524]  55.88,19.05 0 bottom
U$19  [100MA6]  7.37,68.33 270 top
U$20  [500MA101]  13.59,68.2 270 top
U$21  [MAIN_BOARD5523]  31.5,58.8 0 top
U$22  [QWIIC_3MM]  2.54,20.32 0 top
U$23  [STANDOFF501]  3.56,19.05 0 top
U$24  [SFE_LOGO_FLAME_.3]  3.99,13.03 0 top
U$25  [#ALT_PWR_EN0#510]  33.78,61.72 0 top
U$26  [#ALT_PWR_EN1#510]  42.8,61.72 0 top
U$27  [#FC1#G3#518]  36.32,67.06 270 top
U$28  [#FC1#G4#518]  45.21,67.06 270 top
U$29  [#G6#517]  42.65,65.84 270 top
U$30  [#PWR_EN0#517]  31.17,67.51 270 top
U$31  [#PWR_EN1#517]  40.03,67.39 270 top
U$32  [#G5#517]  33.83,65.79 270 top
U$33  [#MEAS#40313513]  14.73,34.67 270 top
VE  9.63,30.51 270 bottom

### Tracks (layer width: path | path; a pad name or v marks a point on that pad's centre or on a via)
3.3V  (via drill 0.3, 0.35)
  Top 0.203: v98.3,68.58 98.3,66.8 99.57,65.53 99.57,64.27 99.44,64.14 99.44,63.05 100.08,62.41 J7.36 | v7.37,62.74 6.1,62.74 5.08,61.72 5.08,59.69 3.82,58.43 J5.1 | R11.2 7.19,33.81 MEAS.4
  Top 0.559: v49.02,68.58 22.63,68.58 16.71,62.66 v16.33,62.66 16.2,62.53 v16.2,43.69 | v10.67,41.91 10.65,41.9 C11.1 | v38.1,29.72 38.1,16.3 37.62,15.82 J2.2 37.6,12.18 37.6,10.03 | C12.1 24.38,17.34 24.38,15.87 J10.4 24.35,12.35 26.67,10.03 37.6,10.03 | J4.2 37.6,10.03
  Bottom 0.203: v16.33,62.66 16.26,62.74 v7.37,62.74 | TP2.1 5.09,55.87 3.75,57.21 J5.1
  Bottom 0.559: v38.1,29.72 38.1,42.49 v38.1,43.69 v19.56,43.69 v16.2,43.69 12.45,43.69 v10.67,41.91 | v49.02,68.58 70.81,68.58 | 70.81,68.58 v70.81,67.03 | v109.42,67.08 109.42,67.56 108.46,68.53 108.46,68.58 v98.3,68.58 70.81,68.58
  pour Top (isolate 0.305, no thermals): 9.88,32.87 9.88,40.32 11.76,40.32 11.76,32.87
  pour Top (isolate 0.305, no thermals): 37.85,45.92 37.85,43.21 38.84,43.21 38.84,43.89 38.28,44.45 38.28,45.92
  pour Top (isolate 0.305, no thermals): 20.07,45.97 19.56,45.97 19.56,44.45 19.3,44.2 19.3,43.18 20.07,43.18
  pour Top (no thermals): 70.84,69.06 71.12,69.06 71.12,66.75 70.61,66.75 70.61,67.51 70.84,67.51
  pour Top (no thermals): 109.22,68.81 109.47,68.81 109.47,67.36 109.65,67.36 109.65,66.78 109.09,66.78 109.09,67.36 109.22,67.36
3.3V_EN  (via drill 0.3)
  Top 0.203: J1.4 20.46,42.55 19.3,41.4 19.3,34.54 18.8,34.04 v18.67,34.04
  Bottom 0.203: v18.67,34.04 17.14,32.51 12.7,32.51 11.1,30.91 VE.1
3.3V_EN_VE  (via drill 0.3)
  Top 0.203: D1.C 7.72,30.07 v7.75,30.1
  Top 0.254: U5.5 11.83,27.96 | 11.83,27.96 11.83,27.07 R9.1 | D1.C 9.89,29.36 11.28,27.96 11.83,27.96
  Bottom 0.203: v7.75,30.1 VE.2
!BOOT!  (via drill 0.3)
  Top 0.203: S2.4 S2.3 8.26,45.09 v8.38,45.21 | J1.11 22.23,52.75 22.23,51.05 v22.07,50.9
  Bottom 0.203: v8.38,45.21 12.17,49 20.17,49 v22.07,50.9
!CS0!-PROCESSOR  (via drill 0.3)
  Top 0.203: v65.02,65.02 65.02,64.62 67.21,62.43 71.55,62.43 72.9,61.09 72.9,58.01 72.14,57.25 65.89,57.25 62.97,54.33 33.58,54.33 33.21,53.96 J1.55 | v65.02,66.55 65.02,68.48 J6.49
  Bottom 0.203: v65.02,66.55 65,66.52 65,65.05 v65.02,65.02
!CS1!-PROCESSOR  (via drill 0.3)
  Top 0.203: J1.70 36.96,43.43 38.05,42.34 53.44,42.34 v62.56,51.46 | v72.24,41.5 72.75,41 79.04,41 89.73,51.69 110.39,51.69 116.23,57.53 116.23,70.1 114.75,71.58 104.85,71.58 103.33,70.06 J7.49
  Bottom 0.203: v62.56,51.46 72.24,41.78 v72.24,41.5
!RESET!  (via drill 0.3)
  Top 0.203: S1.4 4.06,51.82 | 4.06,51.82 S1.3 7.37,51.82 7.11,51.56 v7.11,49.53 | 4.06,51.82 4.12,51.87 J13.1 2.49,55.37 1.37,55.37 0.51,56.24 0.51,62.17 1.84,63.51 J5.10 | v18.14,49.53 19.81,49.53 20.96,48.39 J1.6
  Bottom 0.203: v18.14,49.53 v7.11,49.53
A0-PROCESSOR
  Top 0.203: J1.34 27.96,43.89 28.46,43.39 28.46,37.91 30.68,35.68 57.86,35.68 77.93,55.76 77.93,63.3 75.59,65.63 64.36,65.63 62.23,63.5 J6.38
A1-PROCESSOR  (via drill 0.3)
  Top 0.203: J1.38 28.96,38.37 30.97,36.36 57.12,36.36 77.26,56.5 v77.26,56.52 | J7.38 100.58,58.42 98.55,56.39 86.77,56.39 v81.97,51.59
  Bottom 0.203: v81.97,51.59 81.97,51.82 v77.26,56.52
CTS1-PROCESSOR  (via drill 0.3)
  Top 0.203: J1.15 23.21,58.15 v23.11,58.24 | v28.88,57.84 55.3,57.84 56.72,59.26 56.72,60.96 J6.16
  Bottom 0.203: v28.88,57.84 23.52,57.84 v23.11,58.24
D0-PROCESSOR  (via drill 0.3)
  Top 0.203: J1.10 21.96,43.37 19.81,41.22 19.81,37.47 20.88,36.4 v20.88,36.37 | v27.3,32.77 27.38,32.69 61.42,32.69 74.68,45.95 v74.68,45.97 | v64.26,56.64 65.38,57.76 71.86,57.76 72.14,58.04 72.14,61.37 71.42,62.08 66.88,62.08 v64.52,64.44 | v64.47,67.16 64.48,67.17 J6.47
  Bottom 0.203: v74.68,45.97 64.26,56.39 v64.26,56.64 | v64.47,67.16 64.47,64.49 v64.52,64.44 | v27.3,32.77 27.3,32.69 26.29,31.67 25.58,31.67 v20.88,36.37
D1-PROCESSOR  (via drill 0.3)
  Top 0.203: J1.18 23.96,40.97 v23.11,40.13 | v26.42,36.83 28.63,34.62 59.41,34.62 80.77,55.98 80.77,59.69 85.19,64.11 95.86,64.11 96.83,63.14 v97.05,63.14 | v100.84,65.02 102.16,65.02 102.83,65.7 J7.47
  Bottom 0.203: v23.11,40.13 v26.42,36.83 | v97.05,63.14 100.23,63.14 100.84,63.75 v100.84,65.02
D+
  Top 0.203: J1.3 20.21,51.02 22.1,49.12 24.02,49.12 25.83,47.32 25.83,39.8 19.13,33.1 19.13,17.99 17.85,16.71 17.31,16.71 15.85,15.26 15.85,13.99 15.25,13.39 11.28,9.41 11.28,7.87 10.91,7.51 J3.B6 10.92,6.4 10.92,5.59 10.67,5.33 10.16,5.33 9.91,5.58 J3.A6
D-  (via drill 0.3)
  Top 0.203: v20.32,50.04 20.68,50.04 21.95,48.77 23.88,48.77 25.5,47.14 25.5,39.98 18.8,33.27 18.8,18.13 17.71,17.04 17.17,17.04 15.43,15.3 15.43,14.03 10.95,9.55 10.95,8.2 10.41,7.67 10.41,7.37 | v21.18,50.85 20.73,51.31 20.73,52.75 J1.5 | J3.A7 10.41,7.37 | J3.B7 9.53,6.54 9.53,7.01 9.89,7.37 10.41,7.37
  Bottom 0.203: v21.18,50.85 20.37,50.04 v20.32,50.04
G0-PROCESSOR  (via drill 0.3)
  Top 0.203: v67.31,65.02 67.51,65.02 67.77,65.28 75.18,65.28 76.93,63.52 76.93,57.26 56.53,36.86 31.68,36.86 29.46,39.09 29.46,39.1 J1.40 | v67.06,66.52 66.95,66.62 66.19,66.62 65.95,66.86 65.95,68.5 J6.53
  Bottom 0.203: v67.06,66.52 67.06,65.28 v67.31,65.02
G1-PROCESSOR  (via drill 0.3)
  Top 0.203: v66.8,64.49 67.59,64.49 68.05,64.95 74.68,64.95 76.43,63.2 76.43,57.77 56.02,37.36 32.4,37.36 30,39.76 30,45.18 J1.42 | v66.55,67.13 66.48,67.13 J6.55
  Bottom 0.203: v66.55,67.13 66.55,64.75 v66.8,64.49
G2-PROCESSOR  (via drill 0.3)
  Top 0.203: J6.57 66.98,67.56 67.82,66.73 v67.82,66.55 | v67.82,64.01 68.33,64.52 74.3,64.52 75.8,63.01 75.8,57.93 55.79,37.91 33.14,37.91 30.46,40.6 J1.44
  Bottom 0.203: v67.82,64.01 v67.82,66.55
G3-PROCESSOR  (via drill 0.3)
  Top 0.203: v77.37,66.12 77.37,68.02 75.36,70.03 68,70.03 67.48,69.51 J6.59 | v74.75,63.3 74.75,57.79 55.43,38.46 33.47,38.46 30.96,40.98 J1.46
  Bottom 0.203: v74.75,63.3 74.75,63.5 v77.37,66.12
G4-PROCESSOR/SD_CARD_!CS!  (via drill 0.3)
  Top 0.203: 34.04,39.06 33.53,39.06 31.46,41.14 J1.48 | 34.04,39.06 55.32,39.06 74.13,57.87 74.13,61.25 v73.91,61.47 | v68.33,67.03 67.98,67.38 J6.61 | v33.53,30.73 22.89,30.73 21.67,29.52 21.67,24.66 26.55,19.78 J10.2 | v34.04,39.75 34.04,39.06
  Bottom 0.203: v73.91,61.47 69.85,61.47 68.33,62.99 v68.33,67.03 | v33.53,30.73 34.04,31.24 v34.04,39.75
G5-JUMPER  (via drill 0.3)
  Top 0.203: J1.73 37.71,53.71 37.92,53.92 40.28,53.92 v40.39,53.82 | v40.39,58.42 40.39,59.94 40.21,60.12 34.29,60.12 v33.88,60.53
  Bottom 0.203: v40.39,53.82 v40.39,58.42 | v33.88,60.53 33.78,60.63 J9.2
G5-PROCESSOR  (via drill 0.3)
  Top 0.203: J7.53 104.33,66.1 105.92,64.52 111.25,64.52 112.27,63.5 112.27,59.44 108.2,55.37 87.12,55.37 76.45,44.7 v75.18,44.7 | v65.28,54.36 63.75,54.36 63.17,53.77 42.75,53.77 v42.72,53.75 | v42.67,58.42 42.67,60.68 42.39,60.96 36.4,60.96 v36.32,60.88
  Bottom 0.203: v75.18,44.7 65.53,54.36 v65.28,54.36 | v42.72,53.75 42.72,58.37 v42.67,58.42 | v36.32,60.88 J9.3
G6-JUMPER  (via drill 0.3)
  Top 0.203: v41.94,60.38 41.88,60.33 v41.88,58.45 | J1.71 37.21,50.68 38.1,49.78 41.15,49.78 41.91,50.55 v41.91,53.82
  Bottom 0.203: v41.91,53.82 41.91,58.42 v41.88,58.45 | v41.94,60.38 41.94,62.64 J11.2
G6-PROCESSOR  (via drill 0.3)
  Top 0.203: J7.55 104.83,66.36 106.17,65.02 111.51,65.02 112.78,63.75 112.78,59.18 108.46,54.86 87.38,54.86 76.45,43.94 74.93,43.94 v74.17,44.7 | v43.66,53.24 63.48,53.24 63.83,53.59 v65.02,53.59 | v43.43,58.42 43.43,59.94 43.94,60.45 v44.81,60.45
  Bottom 0.203: v74.17,44.7 65.28,53.59 v65.02,53.59 | v43.66,53.24 43.43,53.47 v43.43,58.42 | v44.81,60.45 45.21,60.86 J11.3
G7-PROCESSOR  (via drill 0.3)
  Top 0.203: v74.14,43.56 74.42,43.28 76.95,43.28 88.03,54.36 109.22,54.36 113.18,58.32 113.18,63.93 111.66,65.46 106.5,65.46 105.33,66.62 J7.57 | J1.69 36.71,50.51 38.01,49.21 41.73,49.21 45.3,52.78 63.89,52.78 v64.14,53.03
  Bottom 0.203: v64.14,53.03 64.66,53.03 v74.14,43.56
G8-PROCESSOR  (via drill 0.3)
  Top 0.203: J1.62 34.96,42.23 36.96,40.23 54.46,40.23 64.57,50.34 v64.75,50.34 | v72.36,42.49 73.18,41.68 78.72,41.68 89.39,52.35 109.89,52.35 115.44,57.9 115.44,69.53 114.01,70.97 106.53,70.97 105.83,70.27 J7.59
  Bottom 0.203: v72.36,42.49 72.36,42.72 v64.75,50.34
G9-PROCESSOR  (via drill 0.3)
  Top 0.203: J1.60 34.46,41.75 36.65,39.56 54.87,39.56 65.58,50.27 v65.66,50.27 | v72.75,43.16 72.76,43.16 73.75,42.16 78.03,42.16 88.88,53.01 109.65,53.01 114.71,58.06 114.71,69.11 113.46,70.36 106.68,70.36 106.33,70.01 J7.61
  Bottom 0.203: v65.66,50.27 65.66,50.16 72.67,43.16 v72.75,43.16
GND  (via drill 0.3)
  Top 0.203: J7.75 109.83,67.84 | v71.55,67.16 71.48,67.23 J6.75 | J6.36 61.73,62.19 v61.26,62.66 | J6.32 60.73,62.13 v61.26,62.66 | v61.26,62.66 61.23,62.63 J6.34 | J7.32 99.08,59.18 | 99.08,59.18 99.08,58.87 v98.72,58.5 | J7.34 99.58,59.68 99.08,59.18
  other vias: 11.02,32.03 7.47,56.54 12.01,54.97 13.59,58.42 14.83,11.58 5.94,11.58 7.19,39.42 7.19,37.64 7.19,35.86 10.57,25.12 10.57,23.32 10.54,21.26 9.25,60.6 9.25,63.27 109.88,69.8 22.58,20.73 21.82,17.81 21.95,14.12 22.94,60.3 21.67,58.01 28.27,61.54 27.86,56.54 19.38,62.84 32.08,51.38 35.97,51.05 24.59,49.89 19.74,50.42 13,50.93 13.16,54.43 9.09,44.07 32.26,16.66 100.25,65.76 94.61,66.04 69.19,66.93 96.04,63.12 52.76,69.95 90.93,70.08 91.31,66.7 74.04,62.48 76.07,66.75 67.08,63.58 65.86,65.02 63.5,65.53 57.56,66.04 57.33,72.87 50.09,64.82 29.26,55.68 30.81,54.69 37.81,51.57 75.7,45.75 71.34,41.48 63.36,52.2 63.41,56.42 79.31,57.23 82.11,52.71 22.42,49.96 27.19,37.32 21.76,39.25 20.03,36.05 34.46,30.36 7.72,32.69 19.76,60.81 31.06,71.35 41.99,71.09 21.03,69.95 14.94,70.46 6.3,70.59 13.31,13.61 17.5,17.93 35.05,46.91 41.01,51.57 44.42,58.39 45.59,60.15 42.67,52.91 35.43,60.78 30.35,60.27 64.64,54.94 37.45,48.26 34.79,50.47
  pour Top (rank 4): 0,73.66 124.46,73.66 124.46,0 0,0
  pour Bottom (rank 4): 0,0 0,73.66 124.46,73.66 124.46,0
HOST_D+
  Top 0.203: J6.35 61.48,66.78 58.97,64.27 58.97,58.68 57,56.71 28.82,56.71 28.21,56.09 J1.35
HOST_D-
  Top 0.203: J6.37 61.98,66.81 59.3,64.13 59.3,58.54 57.13,56.37 29.11,56.37 28.71,55.97 J1.37
I2C_!INT!  (via drill 0.3)
  Top 0.203: v96.77,66.8 96.83,66.86 J7.23 96.83,69.35 96.95,69.47 97.61,69.47 97.79,69.29 97.79,66.04 98.81,65.02 v98.81,62.48 | v95.25,65.28 95,65.02 79.25,65.02 78.13,66.14 78.13,67.97 75.72,70.38 59.16,70.38 58.47,69.7 J6.23 | J1.16 23.46,41.74 22.61,40.89 v22.61,39.62 | v26.14,36.09 28.09,34.14 60.07,34.14 81.53,55.6 81.53,59.69 82.8,60.96 89.69,60.96 91.21,62.48 v97.28,62.48
  Bottom 0.203: v96.77,66.8 v95.25,65.28 | v22.61,39.62 v26.14,36.09 | v97.28,62.48 v98.81,62.48
I2C_SCL  (via drill 0.3)
  Top 0.203: v24.64,34.49 27.03,32.11 38.56,32.11 39.67,30.99 39.67,17.48 39.62,17.42 J2.4 39.62,5.1 J4.4 | v24.13,47.24 22.96,46.07 J1.14 22.96,42.67 21.11,40.82 v21.11,38.02 | v25.58,48.62 25.58,48.77 25.93,49.12 25.93,65.86 27.28,67.21 50.14,67.21 v50.29,67.06 | v57.96,67 57.96,68.5 J6.21 57.98,69.99 v58.14,70.16 | J7.21 96.33,70.87 94.34,72.87 58.42,72.87 v58.37,72.82
  Bottom 0.203: v24.64,34.49 v21.11,38.02 | v50.29,67.06 51.05,67.06 51.31,66.8 57.76,66.8 v57.96,67 | v24.13,47.24 24.16,47.24 25.53,48.62 v25.58,48.62 | v58.37,72.82 58.37,70.38 v58.14,70.16
I2C_SDA  (via drill 0.3)
  Top 0.203: v23.85,34.52 26.85,31.52 37.88,31.52 38.93,30.48 38.93,13.74 38.62,13.44 J2.3 38.6,12.18 J4.3 | v23.88,48.01 22.46,46.59 J1.12 22.46,43.04 20.45,41.03 20.45,37.82 21.16,37.11 v21.18,37.11 | v25.04,49.25 25.6,49.81 25.6,66.27 27.15,67.82 50.09,67.82 v50.09,67.79 | v57.33,67.31 57.48,67.46 J6.19 57.45,68.55 57.45,70.05 v57.4,70.1 | J7.19 95.83,70.28 93.98,72.14 v57.4,72.14
  Bottom 0.203: v23.85,34.52 21.26,37.11 v21.18,37.11 | v50.09,67.79 50.93,67.79 51.41,67.31 v57.33,67.31 | v23.88,48.01 23.88,48.06 25.04,49.23 v25.04,49.25 | v57.4,72.14 v57.4,70.1
N$1
  pour Top (isolate 0.305, no thermals): 13.69,31.01 13.69,32.16 12.42,32.16 12.42,34.7 14.2,34.7 14.2,32.16 13.94,32.16 13.94,31.01
N$2  (via drill 0.3)
  Top 0.203: v3.3,27.94 3.3,27.75 D8.C
  Bottom 0.203: 5V_LED.2 2.25,27.46 2.82,27.46 v3.3,27.94
N$3
  Top 0.203: D3.A 3.04,32.74 2.99,32.69 R11.1
N$4
  Top 0.203: J3.B5 11.91,7.85 12.51,8.45 R2.2
N$5  (via drill 0.3)
  Top 0.203: v8.91,7.39 8.94,7.37 8.91,7.35 J3.A5 | v7.92,8.43 6.87,8.43 R1.2
  Bottom 0.203: v8.91,7.39 7.92,8.38 v7.92,8.43
N$6
  Top 0.203: U2.5 10.58,57.57 11.18,58.17 11.18,63.25 | S3.4 11.18,63.25 | 11.18,63.25 10.16,63.25 9.91,63.5 S3.3
N$7  (via drill 0.3)
  Top 0.254: J3.VBUS1 7.81,6.32 7.81,5.68 8.76,4.72 | J3.VBUS2 12.51,6.32 12.51,5.65 12.19,5.33 12.19,5.2
  Top 0.559: 8.76,4.72 11.71,4.72 12.19,5.2 | F2.1 10.03,9.55 7.71,7.23 J3.VBUS1
  Bottom 0.559: BYP.1 9.96,12.52 v10.08,12.39
  pour Top (isolate 0.305, no thermals): 8.64,10.9 11.43,10.9 11.43,11.66 10.54,11.66 10.54,12.55 9.65,12.55 9.65,11.66 8.64,11.66
N$8
  Top 0.254: S3.1 12.85,72.03 R3.2
N$9
  Top 0.254: S3.2 9.89,72.01 R4.2
N$10  (via drill 0.3)
  Top 0.203: v3.38,31.85 3.38,31.06 3.3,30.99 D3.C
  Bottom 0.203: 3V3_LED.2 3.38,31.82 v3.38,31.85
N$12
  Top 0.203: R8.1 4.3,28.84 D8.A
N$14
  Top 0.203: R5.2 D4.C
N$15  (via drill 0.3)
  Top 0.203: R5.1 4.45,42.04 6.53,44.12 v8.05,44.12 | v13.84,48.34 13.84,57.12 13.4,57.57 U2.1
  Bottom 0.203: v8.05,44.12 12.27,48.34 v13.84,48.34
PROCESSOR_CAN-RX
  Top 0.203: J1.41 29.71,55.33 30.2,55.82 58.01,55.82 59.85,57.66 59.85,63.35 62.99,66.49 62.99,66.5 63.48,66.98 J6.43
PROCESSOR_CAN-TX  (via drill 0.3)
  Top 0.203: v63.67,66.45 63.65,66.45 60.2,62.99 60.2,57.43 58.24,55.47 30.58,55.47 30.21,55.1 J1.43 | v62.97,67.26 62.98,67.27 J6.41
  Bottom 0.203: v63.67,66.45 62.97,67.15 v62.97,67.26
PWM0-PROCESSOR
  Top 0.203: J1.32 27.46,43.68 27.96,43.18 27.96,37.45 30.3,35.11 58.62,35.11 78.71,55.19 78.71,63.52 76.22,66.02 66.27,66.02 65.48,66.8 J6.51
PWM1-PROCESSOR  (via drill 0.3)
  Top 0.203: J7.51 103.83,65.91 101.78,63.86 v100.13,63.86 | J1.47 31.21,54.02 32.03,54.84 60.43,54.84 63.86,58.27 v69.37,58.27 | v96.88,63.86 96.22,64.52 80.52,64.52 79.5,63.5 v79.5,58.17
  Bottom 0.203: v100.13,63.86 v96.88,63.86 | v79.5,58.17 79.4,58.27 v69.37,58.27
PWR_EN0  (via drill 0.3)
  Top 0.203: v74.12,63.7 73.41,62.99 73.41,57.78 72.26,56.64 68.93,56.64 53.9,41.61 37.69,41.61 36.46,42.85 J1.68 36.46,48.24 v36.55,48.34 | v76.86,66.62 76.86,67.87 75.06,69.67 70.69,69.67 70.48,69.46 J6.71 | v39.62,58.42 31.75,58.42 31.5,58.67 v31.5,60.48
  Bottom 0.203: v74.12,63.7 76.86,66.45 v76.86,66.62 | J9.1 31.5,63.37 v31.5,60.48 | v36.55,48.34 36.55,49.25 39.62,52.32 v39.62,58.42
PWR_EN1  (via drill 0.3)
  Top 0.203: v65.28,51.56 65.15,51.69 64.97,51.69 54.16,40.88 37.41,40.88 35.96,42.34 J1.66 35.96,48.66 36.32,49.02 v37.08,49.02 | v73.41,43.43 73.41,43.41 74.04,42.77 77.62,42.77 88.54,53.7 109.37,53.7 113.84,58.17 113.84,64.34 112.29,65.89 109.37,65.89 108.83,66.43 J7.71 | v41.15,58.42 41.17,58.45 v41.17,60.35
  Bottom 0.203: v73.41,43.43 v65.28,51.56 | v37.08,49.02 41.15,53.09 v41.15,58.42 | v41.17,60.35 41.17,61.95 40.13,62.99 J11.1
RTS1-PROCESSOR  (via drill 0.3)
  Top 0.203: J1.13 22.71,53.92 22.61,54.02 v22.61,57.73 | J6.18 57.23,58.75 55.75,57.28 v28.42,57.28
  Bottom 0.203: v28.42,57.28 23.06,57.28 v22.61,57.73
RX1-PROCESSOR  (via drill 0.3)
  Top 0.203: v29.3,60.53 29.3,60.61 30.09,61.4 46.7,61.4 47.34,62.03 52.71,62.03 55.98,65.31 J6.13 | v24.2,60.13 v24.21,60.12 J1.19
  Bottom 0.203: v24.2,60.13 28.91,60.13 v29.3,60.53
RX2-PROCESSOR  (via drill 0.3)
  Top 0.203: J1.20 24.46,40.59 22.45,38.58 v22.45,38.53 | v25.45,35.53 25.45,35.46 27.28,33.63 60.55,33.63 84.58,57.66 96.27,57.66 97.79,59.18 97.79,64.16 94.33,67.62 J7.13
  Bottom 0.203: v25.45,35.53 v22.45,38.53
SHLD
  pour Bottom (isolate 0.305, no thermals): 6.1,6.35 6.1,0 14.73,0 14.73,6.35
  pour Top (isolate 0.305, no thermals): 14.73,6.35 14.73,0 5.84,0 5.84,6.35
SPI_PROCESSOR_SCK  (via drill 0.3)
  Top 0.203: J1.57 33.71,51.59 33.22,51.11 | 33.22,51.11 32.91,50.8 27.69,50.8 27.3,51.18 27.3,63.81 28.93,65.44 53.14,65.44 53.48,65.78 J6.3 53.48,70.47 54.62,71.61 90.83,71.61 91.83,70.61 J7.3 | v34.54,49.78 34.04,49.28 28.96,49.28 26.67,46.99 26.67,42.8 26.92,42.55 26.92,39.22 20.45,32.74 20.45,20.7 23.25,17.9 J10.5 | v32.77,51.56 33.22,51.11
  Bottom 0.203: v34.54,49.78 v32.77,51.56
SPI_PROCESSOR_SDI  (via drill 0.3)
  Top 0.203: J1.61 34.71,51.86 34.76,51.81 34.76,51.23 33.33,49.8 27.94,49.8 | 27.94,49.8 27.27,49.8 26.3,50.77 26.3,65.3 27.55,66.55 50.83,66.55 v50.86,66.52 | J7.7 92.83,66.57 91.72,65.46 88.7,65.46 87.86,66.29 87.86,69.39 86.46,70.79 55.24,70.79 54.48,70.03 J6.7 54.5,68.5 54.5,65.64 53.78,64.92 v50.88,64.92 | 27.94,49.8 27.94,49.28 26.26,47.6 26.26,39.4 19.83,32.96 19.83,18.64 21.05,17.42 J10.7
  Bottom 0.203: v50.86,66.52 50.86,64.95 v50.88,64.92
SPI_PROCESSOR_SDO  (via drill 0.3)
  Top 0.203: J1.59 34.23,52.75 v34.23,51.56 34.23,51.41 33.12,50.3 27.48,50.3 26.8,50.97 26.8,64.74 28.07,66 52.91,66 v52.95,66.04 | J7.5 92.33,66.68 91.44,65.79 88.9,65.79 88.29,66.4 88.29,69.95 87.06,71.19 55.07,71.19 53.98,70.1 J6.5 53.97,66.05 v53.99,66.03 | v35.31,51.56 35.31,49.28 34.73,48.7 29.27,48.7 27.05,46.48 27.05,43.18 27.41,42.82 27.41,38.86 21.13,32.59 21.13,24.08 25.45,19.76 J10.3
  Bottom 0.203: v52.95,66.04 v53.98,66.04 v53.99,66.03 | v35.31,51.56 v34.23,51.56
SWDCK  (via drill 0.3)
  Top 0.203: J1.21 24.71,60.89 24.13,61.47 v19.05,61.47 | v6.86,61.21 6.1,60.45 6.1,56.82 5.41,56.13 1.45,56.13 1.02,56.57 1.02,59.18 1.53,59.7 J5.4
  Bottom 0.203: v19.05,61.47 7.11,61.47 v6.86,61.21
SWDIO  (via drill 0.3)
  Top 0.203: J1.23 25.21,61.41 24.64,61.98 v19.68,61.98 | v6.6,61.98 5.59,60.96 5.59,57.15 5.08,56.64 2.79,56.64 2.48,56.96 J5.2
  Bottom 0.203: J5.2 2.48,55.89 TP1.1 | v19.68,61.98 v6.6,61.98
TX1-PROCESSOR  (via drill 0.3)
  Top 0.203: v23.7,60.7 23.68,60.7 23.68,52.8 J1.17 | v28.63,60.69 29.67,61.73 46.56,61.73 47.22,62.38 52.58,62.38 55.47,65.28 v55.47,66.13 | v56.5,66.15 56.48,66.17 J6.15
  Bottom 0.203: v23.7,60.7 v23.71,60.7 28.62,60.7 v28.63,60.69 | v55.47,66.13 56.48,66.13 v56.5,66.15
TX2-PROCESSOR  (via drill 0.3)
  Top 0.203: J1.22 24.96,40.27 v22.35,37.67 | v24.77,35.48 24.77,35.41 26.87,33.3 60.81,33.3 84.81,57.3 96.44,57.3 98.22,59.08 98.22,64.24 94.83,67.62 J7.15
  Bottom 0.203: v24.77,35.48 22.58,37.67 v22.35,37.67
V_BATT  (via drill 0.3)
  Top 0.559: v17.4,66.29 18.16,67.06 18.16,67.89 J8.2 14.72,67.94 12.46,65.67 C4.1 12.46,59.56 U2.3 14.06,59.47 14.73,58.8 14.73,43.43 16.18,41.99 16.18,19.51 14.83,18.16 Q1.3
  Bottom 0.559: TP3.1 17.37,66.27 v17.4,66.29
VCC  (via drill 0.3)
  Top 0.203: D4.A 1.52,35.47 1.52,30.73 2.29,29.97 5.23,29.97 7.24,27.96 v10.16,27.96
  Top 0.559: U2.4 9.56,59.47 8.76,58.67 8.76,46.1 15.11,39.75 15.11,28.32 14.71,27.91 v14.05,27.91
  Bottom 0.203: v10.16,27.96 10.26,27.86 13.99,27.86 v14.05,27.91
  pour Top (isolate 0.305, no thermals): 13.69,28.85 13.69,27.84 12.93,27.84 12.93,19.68 11.33,19.68 11.33,18.75 14.4,18.75 14.4,28.85
  pour Top (isolate 0.305, no thermals): 10.31,59.16 10.31,59.79 9.04,59.79 8.79,60.05 7.01,60.05 7.01,58.9 8.79,58.9 9.04,59.16
VIN  (via drill 0.3, 0.35, 0.38)
  Top 0.203: R8.2 4.37,26.11 8.89,21.59 8.89,17.4 | R10.2 10.07,52.24 11.46,53.62 v12.98,53.62 | 10.28,15.5 8.89,16.89 8.89,17.4 | R6.2 8.85,17.44 8.89,17.4
  Top 0.254: v20.95,59.31 20.95,57.28 21.71,56.53 J1.9
  Top 0.559: D5.A 13.66,16.23 13.18,15.75 10.52,15.75 10.28,15.5 10.03,15.26 F2.2 | D5.A 15.13,16.91 17.35,19.13 v17.35,53.59 17.35,59.05 v17.55,59.26 | v82.55,59.44 v96.01,59.44 | D5.A 12.22,16.91 Q1.1
  Bottom 0.203: v12.98,53.62 17.32,53.62 v17.35,53.59
  Bottom 0.559: v17.55,59.26 17.6,59.31 v20.95,59.31 70.94,59.31 v70.97,59.33 82.45,59.33 v82.55,59.44 | v109.32,59.41 109.33,59.42 109.32,59.44 v96.01,59.44 | v10.03,13.44 9.93,13.34 BYP.2 6.2,13.34 TP4.1
  pour Top (no thermals): 108.97,61.72 109.22,61.72 109.22,59.94 109.47,59.94 109.47,61.72 109.73,61.72 109.73,59.94 109.88,59.94 109.88,58.9 108.86,58.9 108.86,59.94 108.97,59.94
  pour Top (no thermals): 70.61,61.72 70.87,61.72 70.87,59.94 71.12,59.94 71.12,61.72 71.37,61.72 71.37,59.94 71.53,59.94 71.53,58.78 70.36,58.78 70.36,59.94 70.61,59.94
  pour Top (isolate 0.305, no thermals): 8.64,14.71 8.64,13.69 9.65,13.69 9.65,13.11 10.41,13.11 10.41,13.69 11.43,13.69 11.43,14.71
VIN/3  (via drill 0.3)
  Top 0.203: J1.49 31.71,51.82 31.4,51.51 v27.99,51.51 | R7.2 11.77,50.27 | 11.77,50.27 R10.1 | v12.8,50.27 11.77,50.27
  Bottom 0.203: v27.99,51.51 19,51.51 17.8,50.32 12.85,50.32 v12.8,50.27

### Text on the board
Bottom: v10
tPlace: - | +
Measures: Units in Inches
tDocu: Elias Santistevan